# Altium project MOTOR_DRIVER.PrjPcb (part 1 of 2)
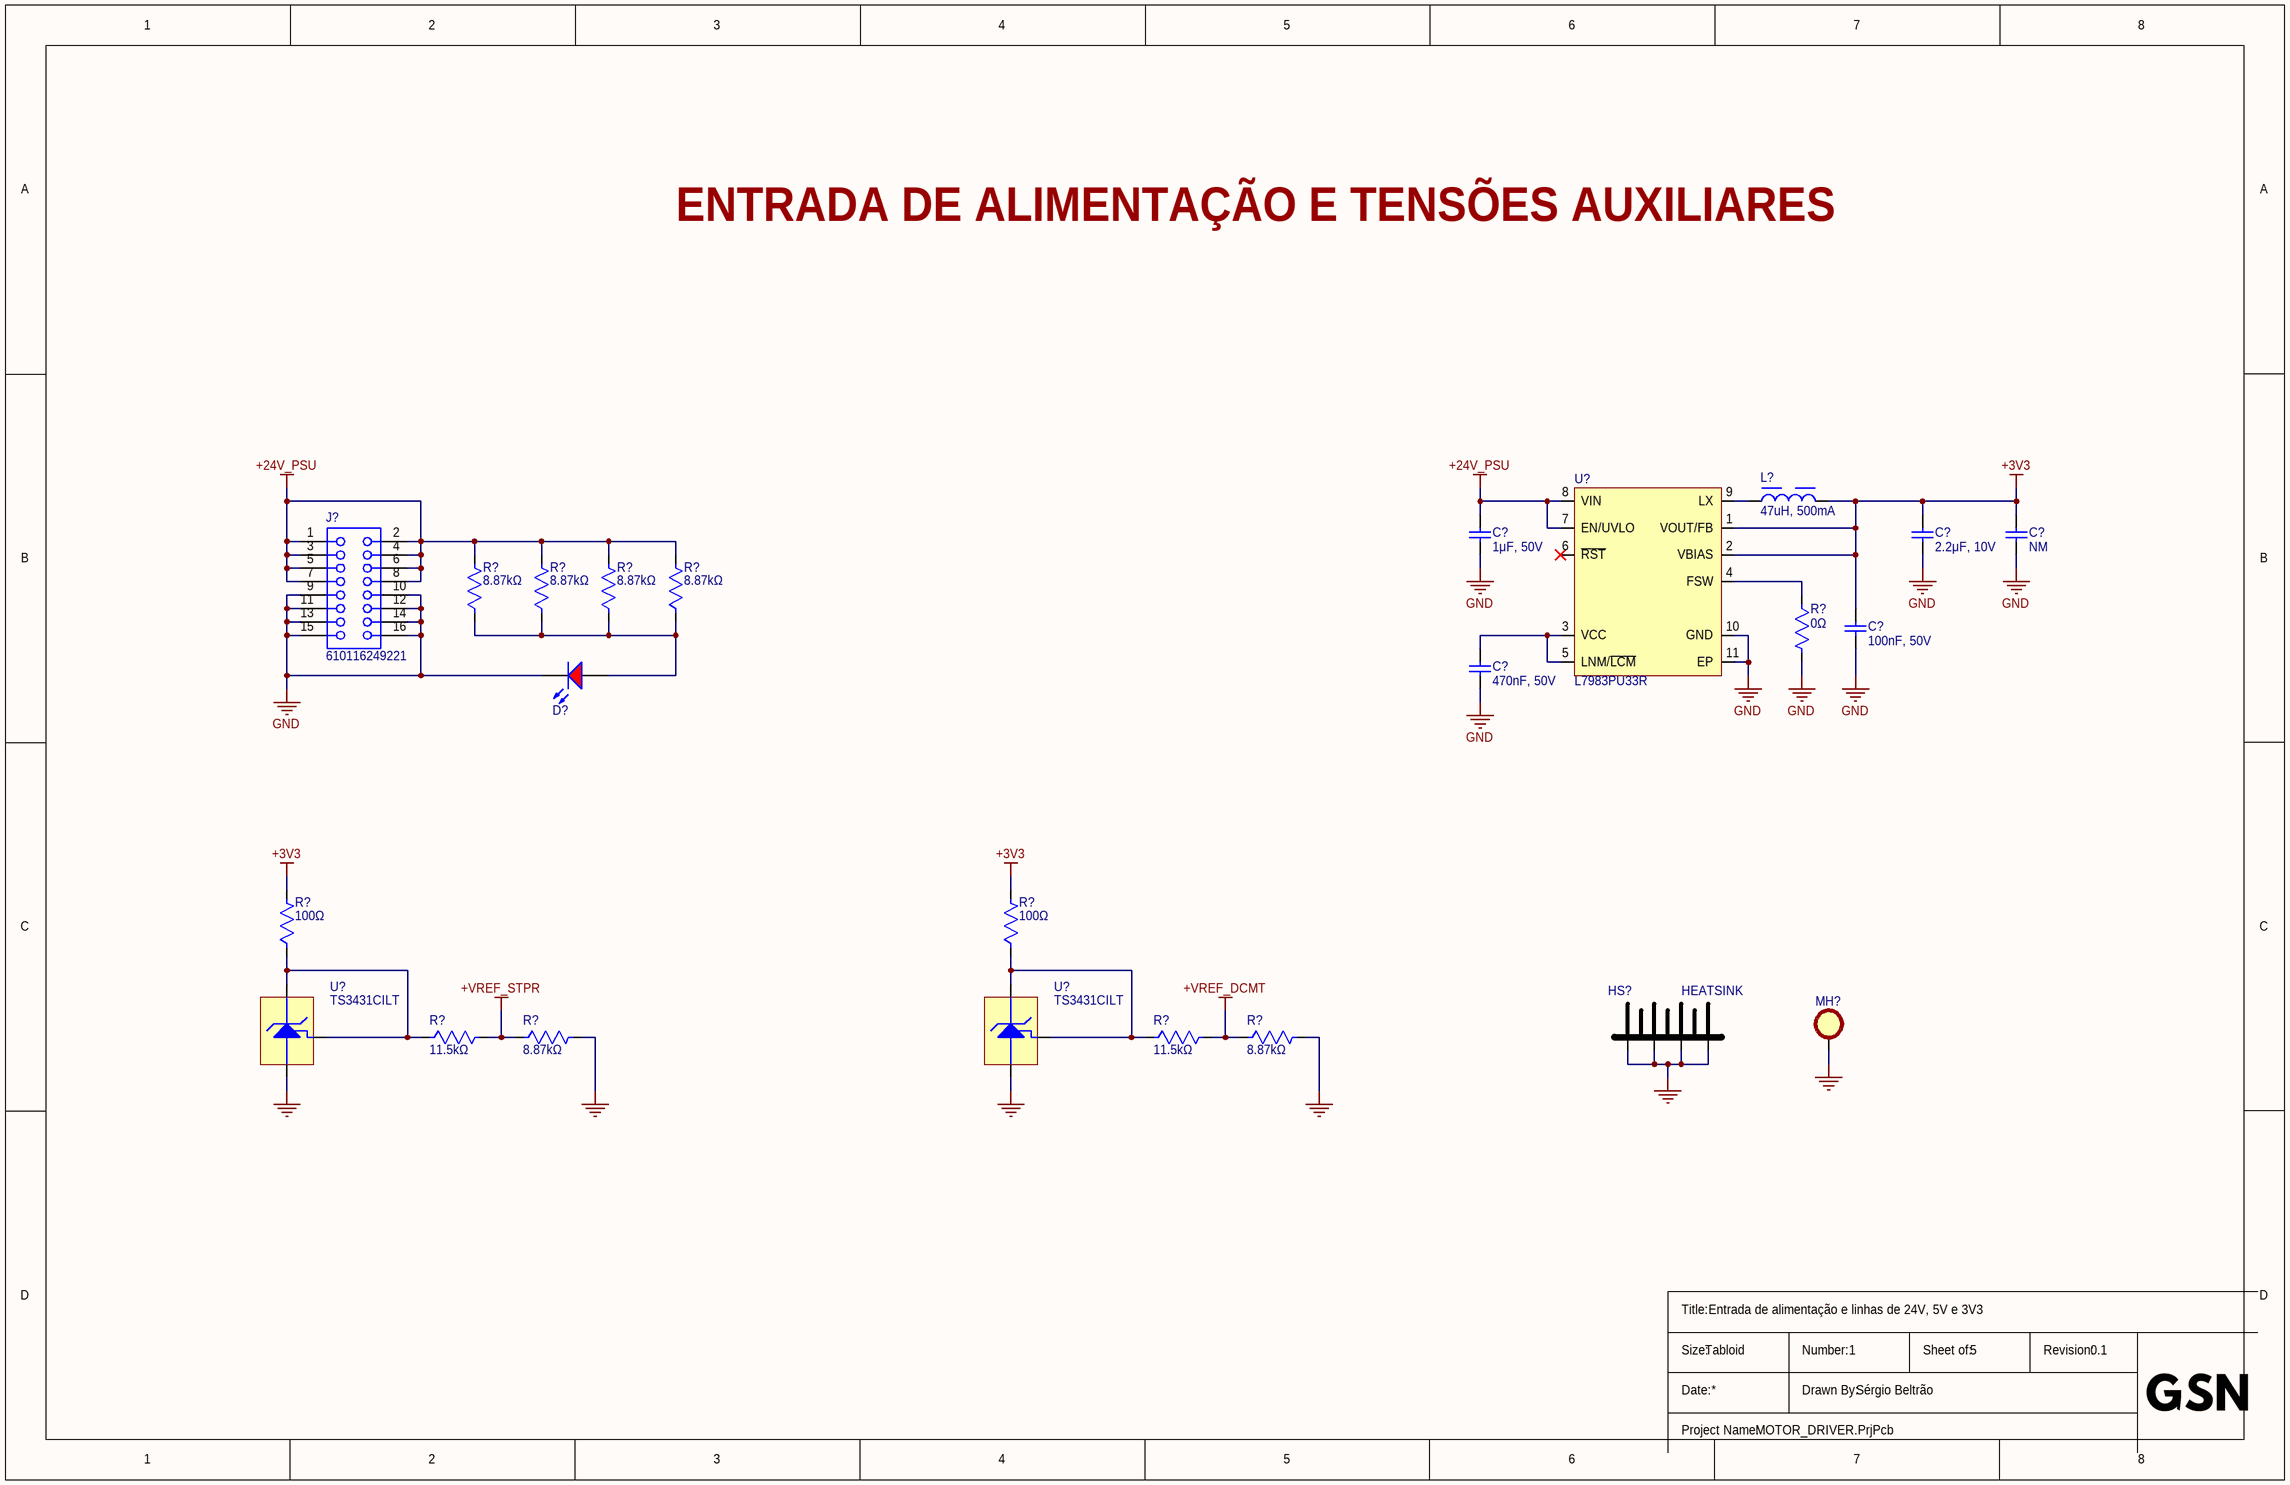
[diagram p0: 1_ENTRADA_DE_ALIMENTACAO.SchDoc]
DrawnBy: Sérgio Beltrão; Revision: 0.1
4 sheets, 121 parts. Net scope: global (net labels, ports and power ports of the same name join across sheets).
Board file: MOTOR_DRIVER.PcbDoc
Sheets:
  1_ENTRADA_DE_ALIMENTACAO.SchDoc
  2_MOTORES_DE_PASSO.SchDoc
  3_MOTORES_DC.SchDoc
  5_IO_EXTERNOS.SchDoc

## Sheet 1_ENTRADA_DE_ALIMENTACAO.SchDoc
size Tabloid; SheetNumber: 1; SheetTotal: 5; SPICEModelCacheBKPNJEUB: <root> / <DocumentId>BKPNJEUB</DocumentId> / <CacheFrame Number="0"> / <Model Name="0603_885012206095_100nf" Kind="CKT"> / <Text>******* / .subckt 0603_885012206095_100nF 1 2 / Rser 1 3 0.0157659152881 / Lser 2 4 3.10171966E-10 / C1 3 4 0.0000001 / Rpar 3 4 5000000000 / .ends 0603_885012206095_100nF</Text> / </Model> / <Model Name="0805_150080rs75000" Kind="CKT"> / <Text>****** / .subckt 0805_150080RS75000  1  2 / D1 1 2 SMCW / .MODEL SMCW D / + IS=10.000E-21 / + N=1.6992 / + RS=1.0000E-6 / + IKF=1.2373E-3 / + CJO=1.0000E-12 / + M=.3333 / + VJ=.75 / + BV=5 / + IBV=10.00E-6 / + TT=5.0000E-9 / .ends</Text> / </Model> / <Model Name="0805_885012207103r_1uf" Kind="CKT"> / <Text>******* / .subckt 0805_885012207103R_1uF 1 2 / Rser 1 3 0.0053065272233 / Lser 2 4 2.83466289E-10 / C1 3 4 0.000001 / Rpar 3 4 100000000 / .ends 0805_885012207103R_1uF</Text> / </Model> / <Model Name="0805_885012207102_470nf" Kind="CKT"> / <Text>******* / .subckt 0805_885012207102_470nF 1 2 / Rser 1 3 0.00874819634126 / Lser 2 4 0.000000000465 / C1 3 4 0.00000047 / Rpar 3 4 1100000000 / .ends 0805_885012207102_470nF</Text> / </Model> / <Model Name="3015_78438335470_47u" Kind="CKT"> / <Text>******* / .subckt 3015_78438335470_47u 1 2 / Rp 1 2 42066.66667 / Cp 1 2 7.59833333333333p / Rs 1 N3 2.09 / L1 N3 2 46.1u / .ends 3015_78438335470_47u</Text> / </Model> / <Model Name="0603_885012206022_220nf" Kind="CKT"> / <Text>******* / .subckt 0603_885012206022_220nF 1 2 / Rser 1 3 0.0146862228843 / Lser 2 4 4.43010481E-10 / C1 3 4 0.00000022 / Rpar 3 4 2300000000 / .ends 0603_885012206022_220nF</Text> / </Model> / <Model Name="0603_885012206027_2.2uf" Kind="CKT"> / <Text>******* / .subckt 0603_885012206027_2.2uF 1 2 / Rser 1 3 0.00844425861819 / Lser 2 4 2.90335669E-10 / C1 3 4 0.0000022 / Rpar 3 4 20000000 / .ends 0603_885012206027_2.2uF</Text> / </Model> / </CacheFrame> / </root>

### Parts
(Parts that share a designator on the sheet are numbered #1, #2 ... from top to bottom, then left to right.)
C?#1  1μF, 50V  [WCAP-CSGP_0805_L2W1.25H1.25]
C?#2  2.2μF, 10V  [WCAP-CSGP_0603_L1.6W0.8H0.8_Reflow]
C?#3  NM  [WCAP-CSGP_0603_L1.6W0.8H0.8_Reflow]
C?#4  100nF, 50V  [WCAP-CSGP_0603_L1.6W0.8H0.8_Reflow]
C?#5  470nF, 50V  [WCAP-CSGP_0805_L2W1.25H1.25]
D?  Red, 2V, 140°  [WL-SMCW_0805_150080xx75000]  (value not drawn)
HS?  HEATSINK  [HEATSINK_100MM_60MM_10MM_LAYING_DOWN]
J?#1  610116249221  [610116249221]
L?  47uH, 500mA  [WE-MAIA_3015]
MH?  Mounting Hole 2.5mm  [MOUNTING_HOLE_M2P5_PLATED]  (value not drawn)  (no BOM)
R?#1  0Ω  [0603-REFLOW]
R?#2  8.87kΩ  [0805-REFLOW]
R?#3  8.87kΩ  [0805-REFLOW]
R?#4  8.87kΩ  [0805-REFLOW]
R?#5  8.87kΩ  [0805-REFLOW]
R?#6  100Ω  [0603-REFLOW]
R?#7  100Ω  [0603-REFLOW]
R?#8  11.5kΩ  [0603-REFLOW]
R?#9  8.87kΩ  [0603-REFLOW]
R?#10  11.5kΩ  [0603-REFLOW]
R?#11  8.87kΩ  [0603-REFLOW]
U?#1  L7983PU33R  [10-WFDFN-EP]
U?#2  TS3431CILT  [SOT-23-3]
U?#3  TS3431CILT  [SOT-23-3]

### Nets
+3V3: C?#2.2 C?#3.2 C?#4.2 L?.2 R?#6.2 R?#7.2 U?#1.1(VOUT/FB) U?#1.2(VBIAS)
+24V_PSU: C?#1.2 J?#1.1 J?#1.2 J?#1.3 J?#1.4 J?#1.5 J?#1.6 J?#1.7 J?#1.8 R?#2.2 R?#3.2 R?#4.2 R?#5.2 U?#1.7(EN/UVLO) U?#1.8(VIN)
+VREF_DCMT: R?#10.2 R?#11.1
+VREF_STPR: R?#8.2 R?#9.1
GND: C?#1.1 C?#2.1 C?#3.1 C?#4.1 C?#5.1 D?.1(K) HS?.H1 HS?.H2 HS?.H3 HS?.H4 J?#1.9 J?#1.10 J?#1.11 J?#1.12 J?#1.13 J?#1.14 J?#1.15 J?#1.16 MH?.H R?#1.2 R?#9.2 R?#11.2 U?#1.10(GND) U?#1.11(EP) U?#2.3(ANODE) U?#3.3(ANODE)
NetC?#5_2: C?#5.2 U?#1.3(VCC) U?#1.5(LNM/~{LCM})
NetD?_2: D?.2(A) R?#2.1 R?#3.1 R?#4.1 R?#5.1
NetL?_1: L?.1 U?#1.9(LX)
NetR?#1_1: R?#1.1 U?#1.4(FSW)
NetR?#6_1: R?#6.1 R?#8.1 U?#2.1(REF) U?#2.2(CATHODE)
NetR?#7_1: R?#7.1 R?#10.1 U?#3.1(REF) U?#3.2(CATHODE)

Not connected (* = marked no-connect by the designer): U?#1 6(~{RST})*

### Notes on the sheet
- ENTRADA DE ALIMENTAÇÃO E TENSÕES AUXILIARES
- Entrada de alimentação e linhas de 24V, 5V e 3V3
- Title:
- Size:
- Tabloid
- Number:
- Sheet of:
- Revision:
- Date:
- Project Name:
- Drawn By:

### Library data of the parts
C?#1 = 885012207103R: WCAP-CSGP Multilayer Ceramic Chip Capacitor, General Purpose, size 0805, 1μF, 50V; Manufacturer: Wurth Elektronik; Case/Size Code: 0805; Capacitance: 1uF; Capacitance Tolerance: +/-10%; Ceramic Type: X7R; Dissipation Factor: 10%; Insulation Resistance: 0.1Gohm; Technical Reference: X7R0805105K050DFCT20000; Manufacturer Part Number: 885012207103R; Category: Multilayer Ceramic Chip Capacitors; Match Code: WCAP-CSGP; ComponentLink1Description: Website Link; ComponentLink1URL: https://www.we-online.com/redexpert/article/885012207103R?ad; ComponentLink2Description: Datasheet Link; ComponentLink2URL: https://www.we-online.com/redexpert/spec/885012207103R?ad; Mount: Surface Mount; Operating Temperature Min: -55degC; Operating Temperature Max: 125degC; Packaging: Tape and Reel; Length: 2mm; Width: 1.25mm; Height: 1.25mm; Rated Voltage (DC): 50V
C?#2 = 885012206027: WCAP-CSGP Multilayer Ceramic Chip Capacitor, General Purpose, size 0603, 2.2μF, 10V; Manufacturer: Wurth Elektronik; Case/Size Code: 0603; Capacitance: 2.2uF; Capacitance Tolerance: +/-10%; Ceramic Type: X7R; Dissipation Factor: 10%; Insulation Resistance: 0.02Gohm; Technical Reference: X7R0603225K010DFCT10000; Manufacturer Part Number: 885012206027; Category: Multilayer Ceramic Chip Capacitors; Match Code: WCAP-CSGP; ComponentLink1Description: Website Link; ComponentLink1URL: https://www.we-online.com/redexpert/article/885012206027?ad; ComponentLink2Description: Datasheet Link; ComponentLink2URL: https://www.we-online.com/redexpert/spec/885012206027?ad; Mount: Surface Mount; Operating Temperature Min: -55degC; Operating Temperature Max: 125degC; Packaging: Tape and Reel; Length: 1.6mm; Width: 0.8mm; Height: 0.8mm; Rated Voltage (DC): 10V
C?#3 = 885012206022: WCAP-CSGP Multilayer Ceramic Chip Capacitor, General Purpose, size 0603, 220nF, 10V; Manufacturer: Wurth Elektronik; Case/Size Code: 0603; Capacitance Tolerance: +/-10%; Ceramic Type: X7R; Dissipation Factor: 5%; Insulation Resistance: 2.3Gohm; Technical Reference: X7R0603224K010DFCT10000; Manufacturer Part Number: 885012206022; Category: Multilayer Ceramic Chip Capacitors; Match Code: WCAP-CSGP; ComponentLink1Description: Website Link; ComponentLink1URL: https://www.we-online.com/redexpert/article/885012206022?ad; ComponentLink2Description: Datasheet Link; ComponentLink2URL: https://www.we-online.com/redexpert/spec/885012206022?ad; Mount: Surface Mount; Operating Temperature Min: -55degC; Operating Temperature Max: 125degC; Packaging: Tape and Reel; Length: 1.6mm; Width: 0.8mm; Height: 0.8mm; Capacitance: 220nF; Rated Voltage (DC): 10V
C?#4 = 885012206095: WCAP-CSGP Multilayer Ceramic Chip Capacitor, General Purpose, size 0603, 100nF, 50V; Manufacturer: Wurth Elektronik; Case/Size Code: 0603; Capacitance Tolerance: +/-10%; Ceramic Type: X7R; Dissipation Factor: 3%; Insulation Resistance: 5Gohm; Technical Reference: X7R0603104K050DFCT10000; Manufacturer Part Number: 885012206095; Category: Multilayer Ceramic Chip Capacitors; Match Code: WCAP-CSGP; ComponentLink1Description: Website Link; ComponentLink1URL: https://www.we-online.com/redexpert/article/885012206095?ad; ComponentLink2Description: Datasheet Link; ComponentLink2URL: https://www.we-online.com/redexpert/spec/885012206095?ad; Mount: Surface Mount; Operating Temperature Min: -55degC; Operating Temperature Max: 125degC; Packaging: Tape and Reel; Length: 1.6mm; Width: 0.8mm; Height: 0.8mm; Capacitance: 100nF; Rated Voltage (DC): 50V
C?#5 = 885012207102: WCAP-CSGP Multilayer Ceramic Chip Capacitor, General Purpose, size 0805, 470nF, 50V; Manufacturer: Wurth Elektronik; Case/Size Code: 0805; Capacitance Tolerance: +/-10%; Ceramic Type: X7R; Dissipation Factor: 3%; Insulation Resistance: 1.1Gohm; Technical Reference: X7R0805474K050DFCT10000; Manufacturer Part Number: 885012207102; Category: Multilayer Ceramic Chip Capacitors; Match Code: WCAP-CSGP; ComponentLink1Description: Website Link; ComponentLink1URL: https://www.we-online.com/redexpert/article/885012207102?ad; ComponentLink2Description: Datasheet Link; ComponentLink2URL: https://www.we-online.com/redexpert/spec/885012207102?ad; Mount: Surface Mount; Operating Temperature Min: -55degC; Operating Temperature Max: 125degC; Packaging: Tape and Reel; Length: 2mm; Width: 1.25mm; Height: 1.25mm; Capacitance: 470nF; Rated Voltage (DC): 50V
D? = 150080RS75000: WL-SMCW Mono-color Chip LED Waterclear, SMT, size 0805, Red, 2V, 140°; Manufacturer: Wurth Elektronik; Case/Size Code: 0805; Chip Technology: AlInGaP; Dominant Wavelength: 625nm; Luminous Intensity: 150mcd; Peak Wavelength: 630nm; Manufacturer Part Number: 150080RS75000; Category: Signal LEDs; Match Code: WL-SMCW; ComponentLink1Description: Website Link; ComponentLink1URL: https://www.we-online.com/redexpert/article/150080RS75000?ad; ComponentLink2Description: Datasheet Link; ComponentLink2URL: https://www.we-online.com/redexpert/spec/150080RS75000?ad; Mount: Surface Mount; Min Operating Temperature: -40°C; Max Operating Temperature: 85°C; Packaging: Tape and Reel; Length: 2mm; Width: 1.25mm; Height: 0.7mm; Emitting Color: Red; Forward Voltage: 2V; Viewing Angle: 140°
HS? = GENERIC-HEATSINK-100X60X10MM-LD: GENERIC HEATSINK 100X60X10MM; Manufacturer: OEM; Manufacturer Part Number: None
J?#1 = 610116249221: WR-PHD Socket Header, SMT, Angled, pitch 2.54mm, 2 Row, 16P; Manufacturer: Wurth Elektronik; Contact Resistance: 20mOhm; Rated Current: 3A; Working Voltage: 250V; Withstanding Voltage: 600V; Manufacturer Part Number: 610116249221; Category: Board-to-Board Connectors; Match Code: WR-PHD; ComponentLink1Description: Website Link; ComponentLink1URL: https://www.we-online.com/redexpert/article/610116249221?ad; ComponentLink2Description: Datasheet Link; ComponentLink2URL: https://www.we-online.com/redexpert/spec/610116249221?ad; Mount: Surface Mount; Operating Temperature Min: -40degC; Operating Temperature Max: 105degC; Packaging: Tape and Reel; Gender: Socket Header; Number of Pins: 16; Number of Rows: 2; Orientation: Angled; Lead Pitch: 2.54mm
L? = 78438335470: WE-MAIA SMT Power Inductor, size 3015, 47uH, 0.5A, 2300mohm; Manufacturer: Wurth Elektronik; Case/Size Code: 3015; Saturation Current @ 10%: 0.75A; Saturation Current @ 30%: 1.5A; Self Resonant Frequency: 8MHz; Manufacturer Part Number: 78438335470; Category: Power Inductors; Match Code: WE-MAIA; ComponentLink1Description: Website Link; ComponentLink1URL: https://www.we-online.com/redexpert/article/78438335470?ad; ComponentLink2Description: Datasheet Link; ComponentLink2URL: https://www.we-online.com/redexpert/spec/78438335470?ad; Mount: Surface Mount; Operating Temperature Min: -40degC; Operating Temperature Max: 125degC; Packaging: Tape and Reel; Length: 3mm; Width: 3mm; Height: 1.5mm; Automotive: Yes; DC Resistance Max: 2300mohm; Inductance: 47uH; Rated Current: 0.5A
MH? = MTH-2P5MM-PLATED: PLATED MOUNTING HOLE WITH 2.5MM DIAMETER
R?#1 = RC0603FR-070RL: RES 0 OHM 1% 1/10W 0603; Manufacturer: Yageo Group; Max Power Dissipation: 100mW; Temperature Coefficient: ±200ppm/°C; Voltage Rating (AC): 50V; Voltage Rating: 75V; Supplier Part Number: 311-0.0HRCT-ND; Manufacturer Part Number: RC0603FR-070RL; Value: 0Ω; Case Code (Imperial): 0603; Case Code (Metric): 1608; Case/Package: 0603; Category: Chip SMD Resistors; China RoHS: Non-Compliant; Composition: Thick Film; Contact Plating: Tin; Depth: 800µm; Features: Moisture Resistant; Height: 450µm; Lead Free: Lead Free; Length: 1.6mm; Lifecycle Status: Production; Max Operating Temperature: 155°C; Military Standard: Not; Min Operating Temperature: -55°C; Mounting Technology: Surface Mount; Number of Terminals: 2; Number of Terminations: 2; Packaging: Tape & Reel; Power Dissipation: 100mW; Power Rating: 100mW; Radiation Hardening: No; REACH SVHC: Yes; RoHS: Compliant; Supplier: DigiKey; Termination: SMD/SMT; Tolerance: 1%; Component Link Description: https://www.yageogroup.com/content/datasheet/asset/file/PYU-RC_GROUP_51_ROHS_L; Component Link URL: https://www.yageogroup.com/content/datasheet/asset/file/PYU-RC_GROUP_51_ROHS_L; Datasheet: https://www.yageogroup.com/content/datasheet/asset/file/PYU-RC_GROUP_51_ROHS_L; Voltage Rating (DC): 50V; Weight: 2.012816mg; Width: 800µm; Working Voltage: 75V
R?#2-R?#5 = RC0805FR-078K87L: RES 8.87K OHM 1% 1/8W 0805; Manufacturer: Yageo Group; Max Power Dissipation: 125mW; Temperature Coefficient: 100ppm/°C; Voltage Rating: 150V; Supplier: DigiKey; Supplier Part Number: 311-8.87KCRCT-ND; Manufacturer Part Number: RC0805FR-078K87L; RoHS: Compliant; Category: Chip SMD Resistors; Stock: 98675; Pricing: 1=0.1, 10=0.008, 25=0.0072 (USD); Case/Package: 0805; Case Code (Imperial): 0805; China RoHS: Non-Compliant; Composition: Thick Film; Contact Plating: Lead, Tin; Depth: 1.25mm; Features: Moisture Resistant; Height: 500µm; Lead Free: Lead Free; Length: 2mm; Lifecycle Status: Production; Max Operating Temperature: 155°C; Military Standard: Not; Min Operating Temperature: -55°C; Mounting Technology: Surface Mount; Number of Terminals: 2; Number of Terminations: 2; Power Dissipation: 125mW; Power Rating: 125mW; Radiation Hardening: No; REACH SVHC: Yes; Value: 8.87kΩ; Schedule B: 8533210045, 8533210045|8533210045|8533210045|8533210045|8533210045; Termination: SMD/SMT; Tolerance: 1%; Voltage Rating (DC): 150V; Width: 1.25mm; Working Voltage: 150V; ComponentLink1URL: https://datasheet.octopart.com:443/RC0805FR-078K87L-Yageo-datasheet-175887523.pdf?src-supplier=Newark; ComponentLink1Description: https://datasheet.octopart.com:443/RC0805FR-078K87L-Yageo-datasheet-175887523.pdf?src-supplier=Newark; ComponentLink2URL: https://datasheet.octopart.com:443/RC0805FR-078K87L-Yageo-datasheet-103092701.pdf?src-supplier=Upverter; ComponentLink2Description: https://datasheet.octopart.com:443/RC0805FR-078K87L-Yageo-datasheet-103092701.pdf?src-supplier=Upverter; ComponentLink3URL: https://datasheet.octopart.com:443/RC0805FR-078K87L-Yageo-Group-datasheet-176638170.pdf?src-supplier=Future+Electronics; ComponentLink3Description: https://datasheet.octopart.com:443/RC0805FR-078K87L-Yageo-Group-datasheet-176638170.pdf?src-supplier=Future+Electronics; ComponentLink4URL: https://datasheet.octopart.com:443/RC0805FR-078K87L-Yageo-datasheet-164759695.pdf?src-supplier=Future+Electronics; ComponentLink4Description: https://datasheet.octopart.com:443/RC0805FR-078K87L-Yageo-datasheet-164759695.pdf?src-supplier=Future+Electronics; ComponentLink5URL: https://datasheet.octopart.com:443/RC0805FR-078K87L-Yageo-datasheet-12592811.pdf?src-supplier=Future+Electronics; ComponentLink5Description: https://datasheet.octopart.com:443/RC0805FR-078K87L-Yageo-datasheet-12592811.pdf?src-supplier=Future+Electronics; ComponentLink6URL: https://datasheet.octopart.com:443/RC0805FR-078K87L-Yageo-datasheet-8330313.pdf?src-supplier=Future+Electronics; ComponentLink6Description: https://datasheet.octopart.com:443/RC0805FR-078K87L-Yageo-datasheet-8330313.pdf?src-supplier=Future+Electronics; ComponentLink7URL: https://datasheet.octopart.com:443/RC0805FR-078K87L-Yageo-datasheet-8324252.pdf?src-supplier=Future+Electronics; ComponentLink7Description: https://datasheet.octopart.com:443/RC0805FR-078K87L-Yageo-datasheet-8324252.pdf?src-supplier=Future+Electronics; ComponentLink8URL: https://datasheet.octopart.com/RC0805FR-078K87L-Yageo-datasheet-73766026.pdf; ComponentLink8Description: https://datasheet.octopart.com/RC0805FR-078K87L-Yageo-datasheet-73766026.pdf; ComponentLink9URL: https://datasheet.octopart.com:443/RC0805FR-078K87L-Yageo-datasheet-118657.pdf?src-supplier=DigiKey; ComponentLink9Description: https://datasheet.octopart.com:443/RC0805FR-078K87L-Yageo-datasheet-118657.pdf?src-supplier=DigiKey; ComponentLink10URL: http://sigma.octopart.com:80/conflict_mineral_statement/Yageo-company-3.pdf?src-supplier=Compliance+Statements; ComponentLink10Description: http://sigma.octopart.com:80/conflict_mineral_statement/Yageo-company-3.pdf?src-supplier=Compliance+Statements; ComponentLink11URL: http://sigma.octopart.com:80/rohs_statement/Yageo-company-2.pdf?src-supplier=Compliance+Statements; ComponentLink11Description: http://sigma.octopart.com:80/rohs_statement/Yageo-company-2.pdf?src-supplier=Compliance+Statements
R?#6 R?#7 = RC0603FR-07100RL: RES 100 OHM 1% 1/10W 0603; Manufacturer: Yageo Group; Max Power Dissipation: 100mW; Temperature Coefficient: ±200ppm/°C; Voltage Rating (AC): 50V; Voltage Rating: 75V; Supplier Part Number: 311-100HRCT-ND; Manufacturer Part Number: RC0603FR-07100RL; Value: 100Ω; Case Code (Imperial): 0603; Case Code (Metric): 1608; Case/Package: 0603; Category: Chip SMD Resistors; China RoHS: Non-Compliant; Composition: Thick Film; Contact Plating: Tin; Depth: 800µm; Features: Moisture Resistant; Height: 450µm; Lead Free: Lead Free; Length: 1.6mm; Lifecycle Status: Production; Max Operating Temperature: 155°C; Military Standard: Not; Min Operating Temperature: -55°C; Mounting Technology: Surface Mount; Number of Terminals: 2; Number of Terminations: 2; Packaging: Tape & Reel; Power Dissipation: 100mW; Power Rating: 100mW; Radiation Hardening: No; REACH SVHC: Yes; RoHS: Compliant; Supplier: DigiKey; Termination: SMD/SMT; Tolerance: 1%; Component Link Description: https://www.yageogroup.com/content/datasheet/asset/file/PYU-RC_GROUP_51_ROHS_L; Component Link URL: https://www.yageogroup.com/content/datasheet/asset/file/PYU-RC_GROUP_51_ROHS_L; Datasheet: https://www.yageogroup.com/content/datasheet/asset/file/PYU-RC_GROUP_51_ROHS_L; Voltage Rating (DC): 50V; Weight: 2.012816mg; Width: 800µm; Working Voltage: 75V
R?#8 R?#10 = RC0603FR-0711K5L: RES 11.5K OHM 1% 1/10W 0603; Manufacturer: Yageo Group; Max Power Dissipation: 100mW; Temperature Coefficient: ±200ppm/°C; Voltage Rating (AC): 50V; Voltage Rating: 75V; Supplier Part Number: 311-11.5KHRCT-ND; Manufacturer Part Number: RC0603FR-0711K5L; Value: 11.5kΩ; Case Code (Imperial): 0603; Case Code (Metric): 1608; Case/Package: 0603; Category: Chip SMD Resistors; China RoHS: Non-Compliant; Composition: Thick Film; Contact Plating: Tin; Depth: 800µm; Features: Moisture Resistant; Height: 450µm; Lead Free: Lead Free; Length: 1.6mm; Lifecycle Status: Production; Max Operating Temperature: 155°C; Military Standard: Not; Min Operating Temperature: -55°C; Mounting Technology: Surface Mount; Number of Terminals: 2; Number of Terminations: 2; Packaging: Tape & Reel; Power Dissipation: 100mW; Power Rating: 100mW; Radiation Hardening: No; REACH SVHC: Yes; RoHS: Compliant; Supplier: DigiKey; Termination: SMD/SMT; Tolerance: 1%; Component Link Description: https://www.yageogroup.com/content/datasheet/asset/file/PYU-RC_GROUP_51_ROHS_L; Component Link URL: https://www.yageogroup.com/content/datasheet/asset/file/PYU-RC_GROUP_51_ROHS_L; Datasheet: https://www.yageogroup.com/content/datasheet/asset/file/PYU-RC_GROUP_51_ROHS_L; Voltage Rating (DC): 50V; Weight: 2.012816mg; Width: 800µm; Working Voltage: 75V
R?#9 R?#11 = RC0603FR-078K87L: RES 8.87K OHM 1% 1/10W 0603; Manufacturer: Yageo Group; Max Power Dissipation: 100mW; Temperature Coefficient: ±200ppm/°C; Voltage Rating (AC): 50V; Voltage Rating: 75V; Supplier Part Number: 311-8.87KHRCT-ND; Manufacturer Part Number: RC0603FR-078K87L; Value: 8.87kΩ; Case Code (Imperial): 0603; Case Code (Metric): 1608; Case/Package: 0603; Category: Chip SMD Resistors; China RoHS: Non-Compliant; Composition: Thick Film; Contact Plating: Tin; Depth: 800µm; Features: Moisture Resistant; Height: 450µm; Lead Free: Lead Free; Length: 1.6mm; Lifecycle Status: Production; Max Operating Temperature: 155°C; Military Standard: Not; Min Operating Temperature: -55°C; Mounting Technology: Surface Mount; Number of Terminals: 2; Number of Terminations: 2; Packaging: Tape & Reel; Power Dissipation: 100mW; Power Rating: 100mW; Radiation Hardening: No; REACH SVHC: Yes; RoHS: Compliant; Supplier: DigiKey; Termination: SMD/SMT; Tolerance: 1%; Component Link Description: https://www.yageogroup.com/content/datasheet/asset/file/PYU-RC_GROUP_51_ROHS_L; Component Link URL: https://www.yageogroup.com/content/datasheet/asset/file/PYU-RC_GROUP_51_ROHS_L; Datasheet: https://www.yageogroup.com/content/datasheet/asset/file/PYU-RC_GROUP_51_ROHS_L; Voltage Rating (DC): 50V; Weight: 2.012816mg; Width: 800µm; Working Voltage: 75V
U?#1 = L7983PU33R: IC REG BUCK 3.3V 300MA 10DFN; Manufacturer: STMicroelectronics; Max Supply Voltage: 60V; Max Switching Frequency: 2.42MHz; Min Input Voltage: 3.5V; Min Output Voltage: 850mV; Nominal Supply Voltage: 24V; Number of Circuits: 1; Quiescent Current: 10µA; Synchronous Rectifier: Yes; Supplier: DigiKey; Supplier Part Number: 497-L7983PU33RCT-ND; Manufacturer Part Number: L7983PU33R; RoHS: Compliant; Category: Voltage Regulators - Switching; Stock: 4366; Pricing: 1=2.69, 10=2.001, 25=1.83, 100=1.6411, 250=1.55108, 500=1.5155 (USD); China RoHS: Compliant; Country of Origin: Mainland China; Export Control Classification Number (ECCN) Code: EAR99; Height - Seated (Max): 800µm; Harmonized Tariff Schedule (HTS) Code: 8542.39.00.60; Introduction Date: 2020-10-06; Length: 3mm; Lifecycle Status: Production; Max Operating Temperature: 150°C; Max Output current: 300mA; Max Output Voltage: 60V; Min Operating Temperature: -40°C; Nominal Output Voltage: 3.3V; Number of Terminals: 10; Output Current: 300mA; Packaging: Tape and Reel; REACH SVHC: Yes; Schedule B: 8542390000, 8542390000|8542390000|8542390000|8542390000|8542390000|8542390000|8542390000|8542390000|8542390000|8542390000|8542390000|8542390000|8542390000|8542390000|8542390000|8542390000|8542390000|8542390000|8542390000|8542390000|8542390000|8542390000|8542390000|85; Terminal Pitch: 500µm; Topology: Buck; Width: 3mm
U?#2 U?#3 = TS3431CILT: IC VREF SHUNT ADJ 0.25% SOT23-3; Manufacturer: STMicroelectronics; Cathode Current: 400µA; Max Supply Voltage: 25V; Max Output current: 100mA; Max Output Voltage: 1.243V; Min Output Voltage: 1.237V; Min Supply Voltage: 1.24V; Number of Channels: 1; Output Voltage: 24V; Reference Type: Adjustable, Shunt; Temperature Coefficient: 100ppm/°C; Supplier: DigiKey; Supplier Part Number: 497-4637-1-ND; Manufacturer Part Number: TS3431CILT; RoHS: Compliant; Category: Voltage References; Stock: 16066; Pricing: 1=0.62, 10=0.44, 25=0.3944, 100=0.3441, 250=0.32016, 500=0.30574, 1000=0.29386 (USD); Case/Package: SOT-23; China RoHS: Compliant; Height: 1.02mm; Height - Seated (Max): 1.12mm; Lead Free: Lead Free; Length: 2.9mm; Lifecycle Status: Production; Max Operating Temperature: 125°C; Min Operating Temperature: -40°C; Mounting Technology: Surface Mount; Nominal Supply Voltage: 1.24V; Nominal Output Voltage: 1.24V; Nominal Supply Current: 400µA; Number of Circuits: 1; Number of Outputs: 1; Pins: 3; Number of Terminals: 3; Output Current: 100mA; Packaging: Tape and Reel; Radiation Hardening: No; REACH SVHC: Yes; Reference Voltage: 1.24V; Schedule B: 8542390000, 8542390000|8542390000|8542390000|8542390000|8542390000; Terminal Pitch: 950µm; Termination: SMD/SMT; Tolerance: 0.25%; Width: 1.3mm; ComponentLink1URL: https://datasheet.octopart.com:443/TS3431CILT-STMicroelectronics-datasheet-12523092.pdf?src-supplier=SHENGYU+ELECTRONICS; ComponentLink1Description: https://datasheet.octopart.com:443/TS3431CILT-STMicroelectronics-datasheet-12523092.pdf?src-supplier=SHENGYU+ELECTRONICS; ComponentLink2URL: https://datasheet.octopart.com:443/TS3431CILT-STMicroelectronics-datasheet-10408717.pdf?src-supplier=Upverter; ComponentLink2Description: https://datasheet.octopart.com:443/TS3431CILT-STMicroelectronics-datasheet-10408717.pdf?src-supplier=Upverter; ComponentLink3URL: https://datasheet.octopart.com:443/TS3431CILT-STMicroelectronics-datasheet-124172.pdf?src-supplier=Farnell; ComponentLink3Description: https://datasheet.octopart.com:443/TS3431CILT-STMicroelectronics-datasheet-124172.pdf?src-supplier=Farnell; ComponentLink4URL: https://datasheet.octopart.com:443/TS3431CILT-STMicroelectronics-datasheet-140368796.pdf?src-supplier=TME; ComponentLink4Description: https://datasheet.octopart.com:443/TS3431CILT-STMicroelectronics-datasheet-140368796.pdf?src-supplier=TME; ComponentLink5URL: https://datasheet.octopart.com:443/TS3431CILT-STMicroelectronics-datasheet-18487.pdf?src-supplier=DigiKey; ComponentLink5Description: https://datasheet.octopart.com:443/TS3431CILT-STMicroelectronics-datasheet-18487.pdf?src-supplier=DigiKey

## Sheet 2_MOTORES_DE_PASSO.SchDoc
size Tabloid; SheetNumber: 2; SheetTotal: 4; SPICEModelCacheVFRLFGQA: <root> / <DocumentId>VFRLFGQA</DocumentId> / <CacheFrame Number="0"> / <Model Name="0603_885012206023_330nf" Kind="CKT"> / <Text>******* / .subckt 0603_885012206023_330nF 1 2 / Rser 1 3 0.0113479919005 / Lser 2 4 4.48567636E-10 / C1 3 4 0.00000033 / Rpar 3 4 1500000000 / .ends 0603_885012206023_330nF</Text> / </Model> / <Model Name="0603_885012206008_1nf" Kind="CKT"> / <Text>******* / .subckt 0603_885012206008_1nF 1 2 / Rser 1 3 0.24958 / Lser 2 4 0.00000000040399 / C1 3 4 0.000000001 / Rpar 3 4 10000000000 / .ends 0603_885012206008_1nF</Text> / </Model> / <Model Name="0603_885012206014_10nf" Kind="CKT"> / <Text>******* / .subckt 0603_885012206014_10nF 1 2 / Rser 1 3 0.04641 / Lser 2 4 0.00000000025735 / C1 3 4 0.00000001 / Rpar 3 4 10000000000 / .ends 0603_885012206014_10nF</Text> / </Model> / <Model Name="0603_885012206121_330nf" Kind="CKT"> / <Text>******* / .subckt 0603_885012206121_330nF 1 2 / Rser 1 3 0.0116331902783 / Lser 2 4 2.98906197E-10 / C1 3 4 0.00000033 / Rpar 3 4 1500000000 / .ends 0603_885012206121_330nF</Text> / </Model> / <Model Name="865080649011_33uf" Kind="CKT"> / <Text>******* / .subckt 865080649011_33uF 1 2 / Rser 1 3 0.64 / Lser 2 4 0.000000003917 / C1 3 4 0.000033 / Rpar 3 4 3030303.03030303 / .ends 865080649011_33uF</Text> / </Model> / </CacheFrame> / </root>
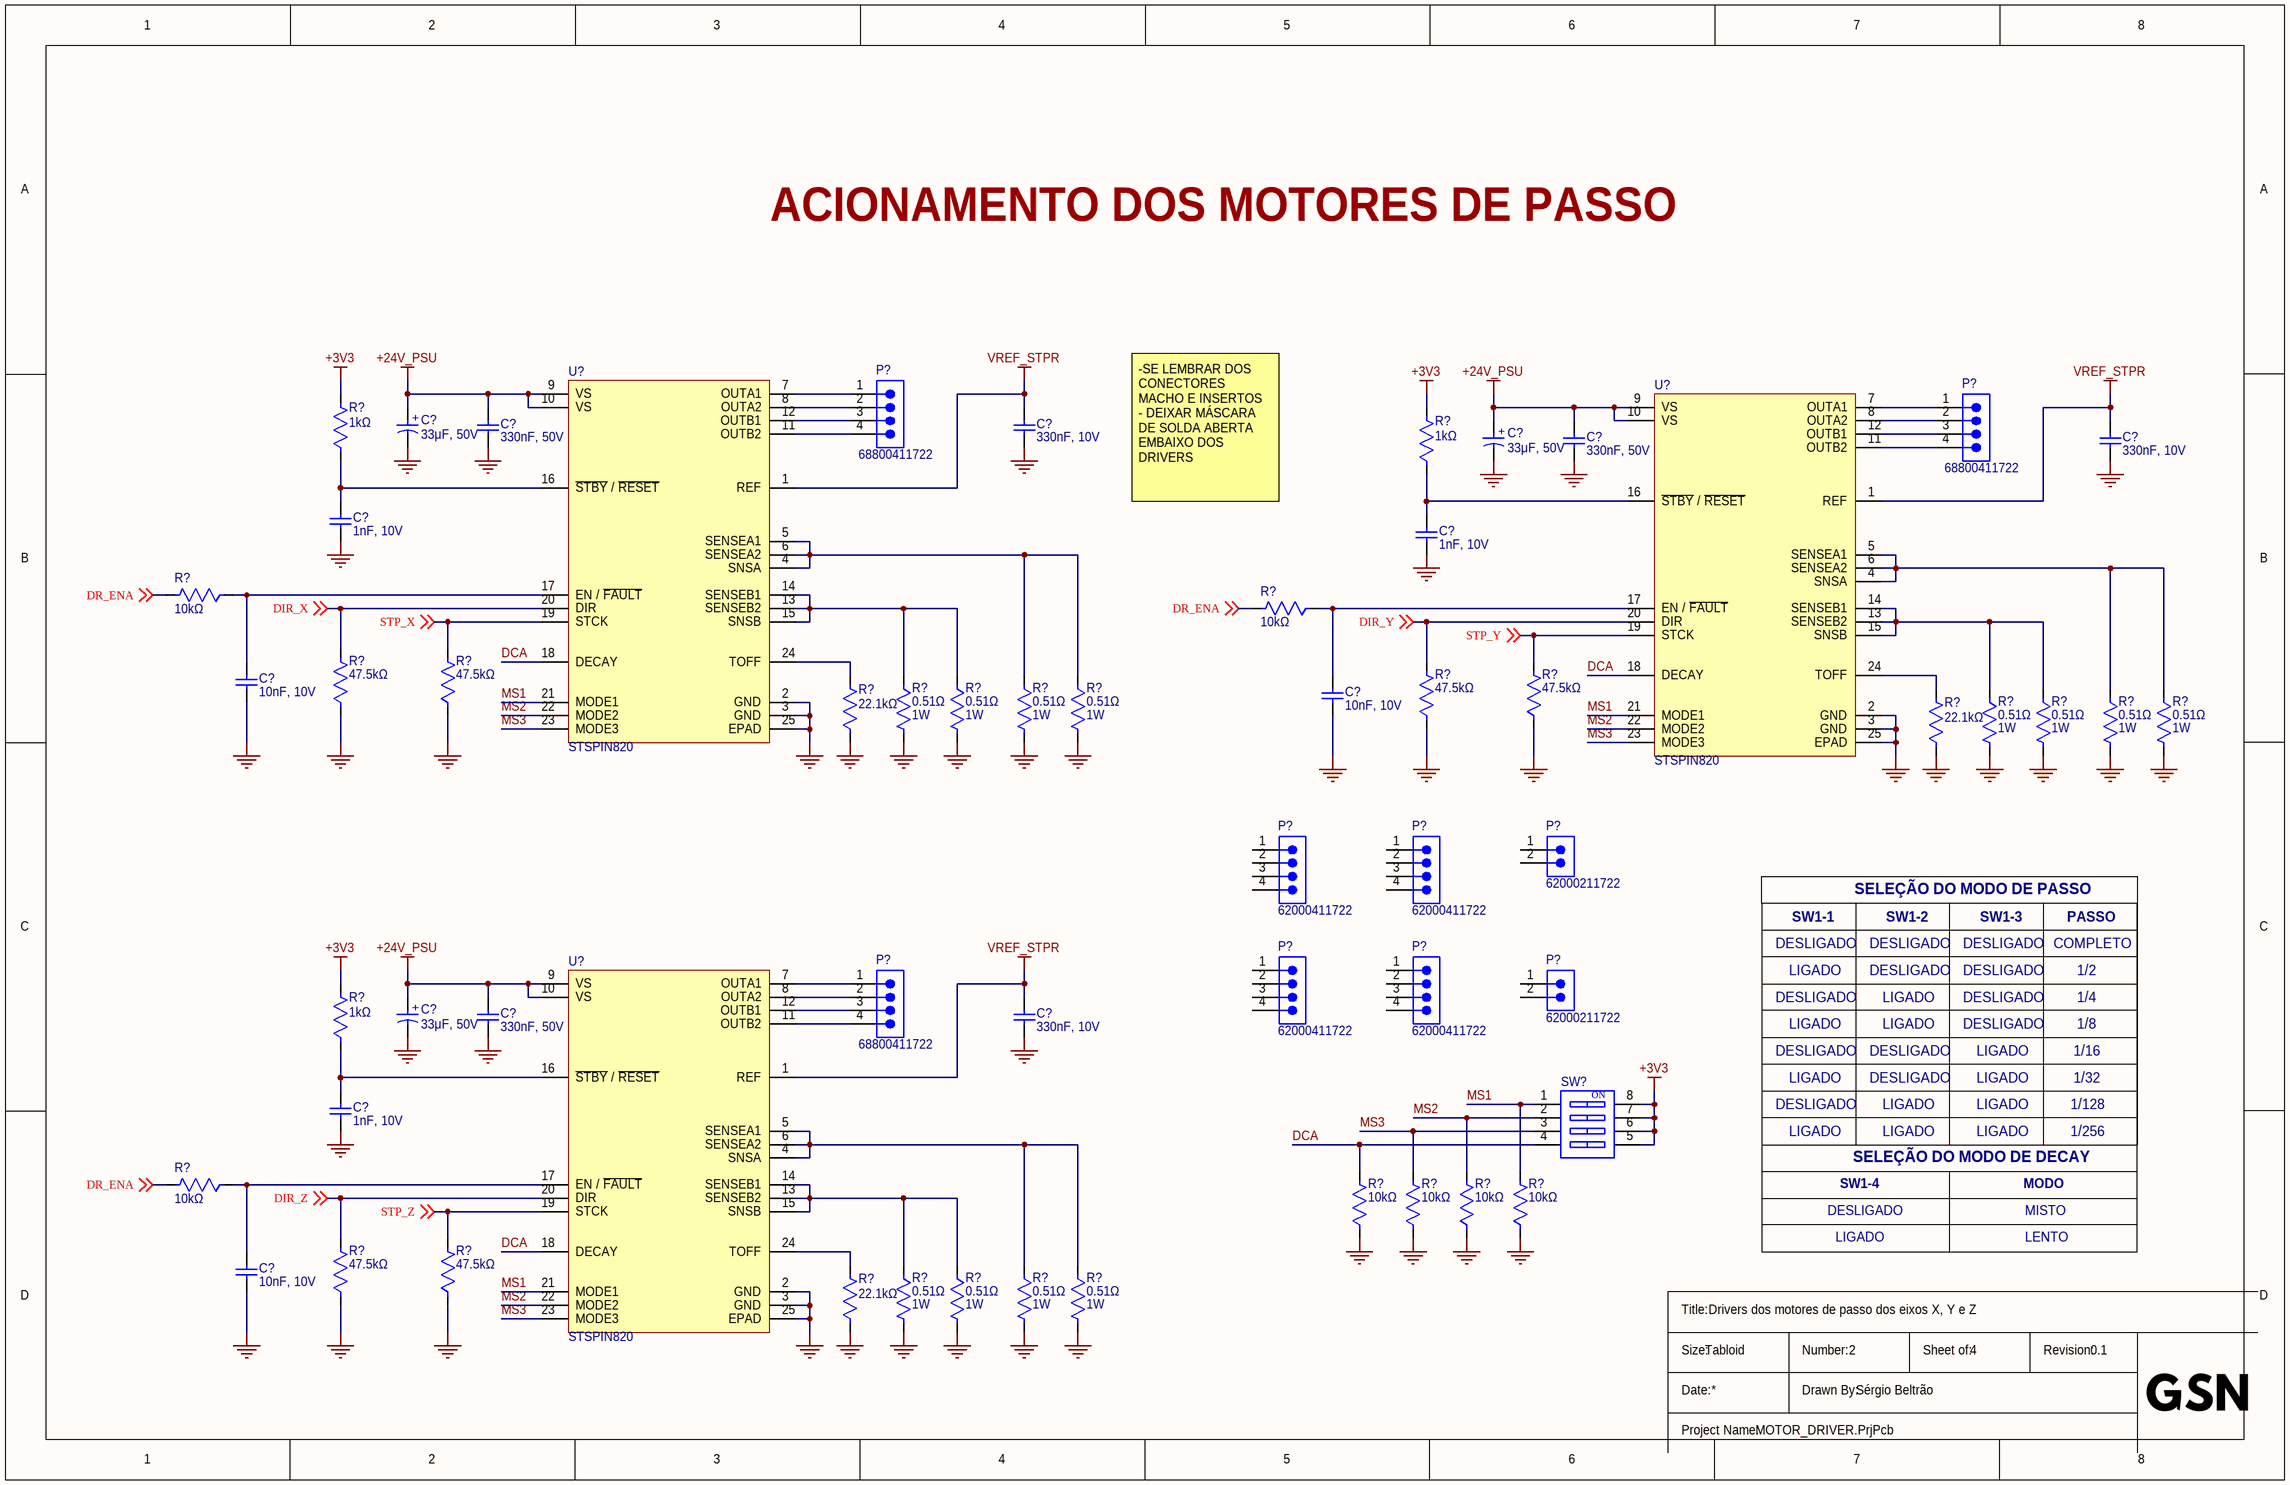
[diagram p1: 2_MOTORES_DE_PASSO.SchDoc]

### Parts
(Parts that share a designator on the sheet are numbered #1, #2 ... from top to bottom, then left to right.)
C?#6  33μF, 50V  [WCAP-ASLI_D8H6.5]
C?#7  33μF, 50V  [WCAP-ASLI_D8H6.5]
C?#8  330nF, 50V  [WCAP-CSGP_0603_L1.6W0.8H0.8_Reflow]
C?#9  330nF, 10V  [WCAP-CSGP_0603_L1.6W0.8H0.8_Reflow]
C?#10  330nF, 50V  [WCAP-CSGP_0603_L1.6W0.8H0.8_Reflow]
C?#11  330nF, 10V  [WCAP-CSGP_0603_L1.6W0.8H0.8_Reflow]
C?#12  1nF, 10V  [WCAP-CSGP_0603_L1.6W0.8H0.8_Reflow]
C?#13  1nF, 10V  [WCAP-CSGP_0603_L1.6W0.8H0.8_Reflow]
C?#14  10nF, 10V  [WCAP-CSGP_0603_L1.6W0.8H0.8_Reflow]
C?#15  10nF, 10V  [WCAP-CSGP_0603_L1.6W0.8H0.8_Reflow]
C?#16  33μF, 50V  [WCAP-ASLI_D8H6.5]
C?#17  330nF, 50V  [WCAP-CSGP_0603_L1.6W0.8H0.8_Reflow]
C?#18  330nF, 10V  [WCAP-CSGP_0603_L1.6W0.8H0.8_Reflow]
C?#19  1nF, 10V  [WCAP-CSGP_0603_L1.6W0.8H0.8_Reflow]
C?#20  10nF, 10V  [WCAP-CSGP_0603_L1.6W0.8H0.8_Reflow]
P?#1  68800411722  [68800411722]
P?#2  68800411722  [68800411722]
P?#3  62000411722  [62000411722]
P?#4  62000411722  [62000411722]
P?#5  62000211722  [62000211722]
P?#6  62000411722  [62000411722]
P?#7  62000411722  [62000411722]
P?#8  68800411722  [68800411722]
P?#9  62000211722  [62000211722]
R?#12  1kΩ  [0603-REFLOW]
R?#13  1kΩ  [0603-REFLOW]
R?#14  10kΩ  [0603-REFLOW]
R?#15  10kΩ  [0603-REFLOW]
R?#16  0.51Ω  Power Rating: 1W  [2010-REFLOW]
R?#17  0.51Ω  Power Rating: 1W  [2010-REFLOW]
R?#18  0.51Ω  Power Rating: 1W  [2010-REFLOW]
R?#19  0.51Ω  Power Rating: 1W  [2010-REFLOW]
R?#20  0.51Ω  Power Rating: 1W  [2010-REFLOW]
R?#21  0.51Ω  Power Rating: 1W  [2010-REFLOW]
R?#22  0.51Ω  Power Rating: 1W  [2010-REFLOW]
R?#23  0.51Ω  Power Rating: 1W  [2010-REFLOW]
R?#24  47.5kΩ  [0603-REFLOW]
R?#25  47.5kΩ  [0603-REFLOW]
R?#26  47.5kΩ  [0603-REFLOW]
R?#27  47.5kΩ  [0603-REFLOW]
R?#28  22.1kΩ  [0603-REFLOW]
R?#29  22.1kΩ  [0603-REFLOW]
R?#30  1kΩ  [0603-REFLOW]
R?#31  10kΩ  [0603-REFLOW]
R?#32  10kΩ  [0603-REFLOW]
R?#33  10kΩ  [0603-REFLOW]
R?#34  10kΩ  [0603-REFLOW]
R?#35  10kΩ  [0603-REFLOW]
R?#36  0.51Ω  Power Rating: 1W  [2010-REFLOW]
R?#37  0.51Ω  Power Rating: 1W  [2010-REFLOW]
R?#38  0.51Ω  Power Rating: 1W  [2010-REFLOW]
R?#39  0.51Ω  Power Rating: 1W  [2010-REFLOW]
R?#40  47.5kΩ  [0603-REFLOW]
R?#41  47.5kΩ  [0603-REFLOW]
R?#42  22.1kΩ  [0603-REFLOW]
SW?  416131160804  [416131160804]  (value not drawn)
U?#4  STSPIN820  [24-TQFPN]
U?#5  STSPIN820  [24-TQFPN]
U?#6  STSPIN820  [24-TQFPN]

### Nets
+3V3: R?#12.2 R?#13.2 R?#30.2 SW?.5 SW?.6 SW?.7 SW?.8
+24V_PSU: C?#6.1(P) C?#7.1(P) C?#8.2 C?#10.2 C?#16.1(P) C?#17.2 U?#4.9(VS) U?#4.10(VS) U?#5.9(VS) U?#5.10(VS) U?#6.9(VS) U?#6.10(VS)
GND: C?#6.2(N) C?#7.2(N) C?#8.1 C?#9.1 C?#10.1 C?#11.1 C?#12.1 C?#13.1 C?#14.1 C?#15.1 C?#16.2(N) C?#17.1 C?#18.1 C?#19.1 C?#20.1 R?#16.2 R?#17.2 R?#18.2 R?#19.2 R?#20.2 R?#21.2 R?#22.2 R?#23.2 R?#24.1 R?#25.1 R?#26.1 R?#27.1 R?#28.1 R?#29.1 R?#32.1 R?#33.1 R?#34.1 R?#35.1 R?#36.2 R?#37.2 R?#38.2 R?#39.2 R?#40.1 R?#41.1 R?#42.1 U?#4.2(GND) U?#4.3(GND) U?#4.25(EPAD) U?#5.2(GND) U?#5.3(GND) U?#5.25(EPAD) U?#6.2(GND) U?#6.3(GND) U?#6.25(EPAD)
VREF_STPR: C?#9.2 C?#11.2 C?#18.2 U?#4.1(REF) U?#5.1(REF) U?#6.1(REF)
DCA: R?#32.2 SW?.4 U?#4.18(DECAY) U?#5.18(DECAY) U?#6.18(DECAY)
DIR_X: R?#24.2 U?#4.20(DIR) ; off-sheet DIR_X
DIR_Y: R?#26.2 U?#5.20(DIR) ; off-sheet DIR_Y
DIR_Z: R?#40.2 U?#6.20(DIR) ; off-sheet DIR_Z
DR_ENA: R?#14.2 R?#15.2 R?#31.2 ; off-sheet DR_ENA
MS1: R?#35.2 SW?.1 U?#4.21(MODE1) U?#5.21(MODE1) U?#6.21(MODE1)
MS2: R?#34.2 SW?.2 U?#4.22(MODE2) U?#5.22(MODE2) U?#6.22(MODE2)
MS3: R?#33.2 SW?.3 U?#4.23(MODE3) U?#5.23(MODE3) U?#6.23(MODE3)
STP_X: R?#25.2 U?#4.19(STCK) ; off-sheet STP_X
STP_Y: R?#27.2 U?#5.19(STCK) ; off-sheet STP_Y
STP_Z: R?#41.2 U?#6.19(STCK) ; off-sheet STP_Z
NetC?#12_2: C?#12.2 R?#12.1 U?#4.16(~{STBY}_/_~{RESET})
NetC?#13_2: C?#13.2 R?#13.1 U?#5.16(~{STBY}_/_~{RESET})
NetC?#14_2: C?#14.2 R?#14.1 U?#4.17(EN_/_~{FAULT})
NetC?#15_2: C?#15.2 R?#15.1 U?#5.17(EN_/_~{FAULT})
NetC?#19_2: C?#19.2 R?#30.1 U?#6.16(~{STBY}_/_~{RESET})
NetC?#20_2: C?#20.2 R?#31.1 U?#6.17(EN_/_~{FAULT})
NetP?#1_1: P?#1.1 U?#4.7(OUTA1)
NetP?#1_2: P?#1.2 U?#4.8(OUTA2)
NetP?#1_3: P?#1.3 U?#4.12(OUTB1)
NetP?#1_4: P?#1.4 U?#4.11(OUTB2)
NetP?#2_1: P?#2.1 U?#5.7(OUTA1)
NetP?#2_2: P?#2.2 U?#5.8(OUTA2)
NetP?#2_3: P?#2.3 U?#5.12(OUTB1)
NetP?#2_4: P?#2.4 U?#5.11(OUTB2)
NetP?#8_1: P?#8.1 U?#6.7(OUTA1)
NetP?#8_2: P?#8.2 U?#6.8(OUTA2)
NetP?#8_3: P?#8.3 U?#6.12(OUTB1)
NetP?#8_4: P?#8.4 U?#6.11(OUTB2)
NetR?#16_1: R?#16.1 R?#17.1 U?#4.13(SENSEB2) U?#4.14(SENSEB1) U?#4.15(SNSB)
NetR?#18_1: R?#18.1 R?#19.1 U?#4.4(SNSA) U?#4.5(SENSEA1) U?#4.6(SENSEA2)
NetR?#20_1: R?#20.1 R?#21.1 U?#5.13(SENSEB2) U?#5.14(SENSEB1) U?#5.15(SNSB)
NetR?#22_1: R?#22.1 R?#23.1 U?#5.4(SNSA) U?#5.5(SENSEA1) U?#5.6(SENSEA2)
NetR?#28_2: R?#28.2 U?#4.24(TOFF)
NetR?#29_2: R?#29.2 U?#5.24(TOFF)
NetR?#36_1: R?#36.1 R?#37.1 U?#6.13(SENSEB2) U?#6.14(SENSEB1) U?#6.15(SNSB)
NetR?#38_1: R?#38.1 R?#39.1 U?#6.4(SNSA) U?#6.5(SENSEA1) U?#6.6(SENSEA2)
NetR?#42_2: R?#42.2 U?#6.24(TOFF)

Not connected (* = marked no-connect by the designer): P?#3 1 2 3 4; P?#4 1 2 3 4; P?#5 1 2; P?#6 1 2 3 4; P?#7 1 2 3 4; P?#9 1 2

### Notes on the sheet
- ACIONAMENTO DOS MOTORES DE PASSO
- -SE LEMBRAR DOS CONECTORES MACHO E INSERTOS
  - DEIXAR MÁSCARA DE SOLDA ABERTA EMBAIXO DOS DRIVERS
- SELEÇÃO DO MODO DE PASSO
- DESLIGADO
- SW1-1
- SW1-2
- SW1-3
- COMPLETO
- PASSO
- LIGADO
- 1/2
- 1/4
- 1/8
- 1/16
- 1/32
- SELEÇÃO DO MODO DE DECAY
- 1/128
- 1/256
- SW1-4
- MODO
- MISTO
- LENTO
- Drivers dos motores de passo dos eixos X, Y e Z
- Title:
- Size:
- Tabloid
- Number:
- Sheet of:
- Revision:
- Date:
- Project Name:
- Drawn By:
- (in symbol 416131160804) ON
- (in symbol 865080649011) +

### Library data of the parts
C?#6 C?#7 C?#16 = 865080649011: WCAP-ASLI Aluminum Electrolytic Capacitor, V-Chip, SMT, 8mm x 6.5mm, 33μF, 50V; Manufacturer: Wurth Elektronik; Capacitance: 33uF; Dissipation Factor: 12%; Endurance: 2000h; Impedance: 700mohm; Leakage Current: 16.5uA; Ripple Current: 200mA; Manufacturer Part Number: 865080649011; Category: Aluminum Electrolytic Capacitors; Match Code: WCAP-ASLI; ComponentLink1Description: Website Link; ComponentLink1URL: https://www.we-online.com/redexpert/article/865080649011?ad; ComponentLink2Description: Datasheet Link; ComponentLink2URL: https://www.we-online.com/redexpert/spec/865080649011?ad; Mount: Surface Mount; Operating Temperature Min: -55degC; Operating Temperature Max: 105degC; Packaging: Tape and Reel; Height: 6.5mm; Diameter: 8mm; Rated Voltage (DC): 50V
C?#8 C?#10 C?#17 = 885012206121: WCAP-CSGP Multilayer Ceramic Chip Capacitor, General Purpose, size 0603, 330nF, 50V; Manufacturer: Wurth Elektronik; Case/Size Code: 0603; Capacitance Tolerance: +/-10%; Ceramic Type: X7R; Dissipation Factor: 10%; Insulation Resistance: 1.5GΩ; Technical Reference: X7R0603334K050DFCT10000; Manufacturer Part Number: 885012206121; Category: Multilayer Ceramic Chip Capacitors; Match Code: WCAP-CSGP; ComponentLink1Description: Website Link; ComponentLink1URL: https://www.we-online.com/redexpert/article/885012206121?ad; ComponentLink2Description: Datasheet Link; ComponentLink2URL: https://www.we-online.com/redexpert/spec/885012206121?ad; Mount: Surface Mount; Min Operating Temperature: -55°C; Max Operating Temperature: 125°C; Packaging: Tape and Reel; Length: 1.6mm; Width: 0.8mm; Height: 0.8mm; Capacitance: 330nF; Rated Voltage (DC): 50V
C?#9 C?#11 C?#18 = 885012206023: WCAP-CSGP Multilayer Ceramic Chip Capacitor, General Purpose, size 0603, 330nF, 10V; Manufacturer: Wurth Elektronik; Case/Size Code: 0603; Capacitance Tolerance: +/-10%; Ceramic Type: X7R; Dissipation Factor: 10%; Insulation Resistance: 1.5GΩ; Technical Reference: X7R0603334K010DFCT10000; Manufacturer Part Number: 885012206023; Category: Multilayer Ceramic Chip Capacitors; Match Code: WCAP-CSGP; ComponentLink1Description: Website Link; ComponentLink1URL: https://www.we-online.com/redexpert/article/885012206023?ad; ComponentLink2Description: Datasheet Link; ComponentLink2URL: https://www.we-online.com/redexpert/spec/885012206023?ad; Mount: Surface Mount; Min Operating Temperature: -55°C; Max Operating Temperature: 125°C; Packaging: Tape and Reel; Length: 1.6mm; Width: 0.8mm; Height: 0.8mm; Capacitance: 330nF; Rated Voltage (DC): 10V
C?#12 C?#13 C?#19 = 885012206008: WCAP-CSGP Multilayer Ceramic Chip Capacitor, General Purpose, size 0603, 1nF, 10V; Manufacturer: Wurth Elektronik; Case/Size Code: 0603; Capacitance Tolerance: +/-10%; Ceramic Type: X7R; Dissipation Factor: 5%; Insulation Resistance: 10GΩ; Technical Reference: X7R0603102K010DFCT10000; Manufacturer Part Number: 885012206008; Category: Multilayer Ceramic Chip Capacitors; Match Code: WCAP-CSGP; ComponentLink1Description: Website Link; ComponentLink1URL: https://www.we-online.com/redexpert/article/885012206008?ad; ComponentLink2Description: Datasheet Link; ComponentLink2URL: https://www.we-online.com/redexpert/spec/885012206008?ad; Mount: Surface Mount; Min Operating Temperature: -55°C; Max Operating Temperature: 125°C; Packaging: Tape and Reel; Length: 1.6mm; Width: 0.8mm; Height: 0.8mm; Capacitance: 1nF; Rated Voltage (DC): 10V
C?#14 C?#15 C?#20 = 885012206014: WCAP-CSGP Multilayer Ceramic Chip Capacitor, General Purpose, size 0603, 10nF, 10V; Manufacturer: Wurth Elektronik; Case/Size Code: 0603; Capacitance Tolerance: +/-10%; Ceramic Type: X7R; Dissipation Factor: 5%; Insulation Resistance: 10GΩ; Technical Reference: X7R0603103K010DFCT10000; Manufacturer Part Number: 885012206014; Category: Multilayer Ceramic Chip Capacitors; Match Code: WCAP-CSGP; ComponentLink1Description: Website Link; ComponentLink1URL: https://www.we-online.com/redexpert/article/885012206014?ad; ComponentLink2Description: Datasheet Link; ComponentLink2URL: https://www.we-online.com/redexpert/spec/885012206014?ad; Mount: Surface Mount; Min Operating Temperature: -55°C; Max Operating Temperature: 125°C; Packaging: Tape and Reel; Length: 1.6mm; Width: 0.8mm; Height: 0.8mm; Capacitance: 10nF; Rated Voltage (DC): 10V
P?#1 P?#2 P?#8 = 68800411722: WR-WTB “J” Type THT Male Horizontal Shrouded Header, pitch 2.5 mm, 4 pins; Manufacturer: Wurth Elektronik; Contact Resistance: 20 mohm; Rated Current: 3 A; Working Voltage: 250 V(AC); Withstanding Voltage: 800 V(AC); Manufacturer Part Number: 68800411722; Category: Wire-to-Board Connector; Match Code: WR-WTB; ComponentLink1Description: Website Link; ComponentLink1URL: https://www.we-online.com/redexpert/article/68800411722?ad; ComponentLink2Description: Datasheet Link; ComponentLink2URL: https://www.we-online.com/redexpert/spec/68800411722?ad; Mount: Through Hole; Operating Temperature Min: -25degC; Operating Temperature Max: 85degC; Packaging: Bag; Length: 12.5 mm; Width: 8.3 mm; Height: 4.2 mm; Gender: Male; Number of Pins: 4; Number of Rows: 1; Orientation: Horizontal; Lead Pitch: 2.5 mm
P?#3 P?#4 P?#6 P?#7 = 62000411722: WR-WTB THT Male Horizontal Shrouded Header, pitch 2 mm, 4 pins; Manufacturer: Wurth Elektronik; Contact Resistance: 20 mohm; Rated Current: 2 A; Working Voltage: 125 V(AC); Withstanding Voltage: 800 V(AC); Manufacturer Part Number: 62000411722; Category: Wire-to-Board Connector; Match Code: WR-WTB; ComponentLink1Description: Website Link; ComponentLink1URL: https://www.we-online.com/redexpert/article/62000411722?ad; ComponentLink2Description: Datasheet Link; ComponentLink2URL: https://www.we-online.com/redexpert/spec/62000411722?ad; Mount: Through Hole; Operating Temperature Min: -25degC; Operating Temperature Max: 85degC; Packaging: Bag; Length: 10 mm; Width: 7.6 mm; Height: 4.5 mm; Gender: Male; Number of Pins: 4; Number of Rows: 1; Orientation: Horizontal; Lead Pitch: 2 mm
P?#5 P?#9 = 62000211722: WR-WTB THT Male Horizontal Shrouded Header, pitch 2 mm, 2 pins; Manufacturer: Wurth Elektronik; Contact Resistance: 20 mohm; Rated Current: 2 A; Working Voltage: 125 V(AC); Withstanding Voltage: 800 V(AC); Manufacturer Part Number: 62000211722; Category: Wire-to-Board Connector; Match Code: WR-WTB; ComponentLink1Description: Website Link; ComponentLink1URL: https://www.we-online.com/redexpert/article/62000211722?ad; ComponentLink2Description: Datasheet Link; ComponentLink2URL: https://www.we-online.com/redexpert/spec/62000211722?ad; Mount: Through Hole; Operating Temperature Min: -25degC; Operating Temperature Max: 85degC; Packaging: Bag; Length: 6 mm; Width: 7.6 mm; Height: 4.5 mm; Gender: Male; Number of Pins: 2; Number of Rows: 1; Orientation: Horizontal; Lead Pitch: 2 mm
R?#12 R?#13 R?#30 = RC0603FR-071KL: RES 1K OHM 1% 1/10W 0603; Manufacturer: Yageo Group; Max Power Dissipation: 100mW; Temperature Coefficient: ±200ppm/°C; Voltage Rating (AC): 50V; Voltage Rating: 75V; Supplier Part Number: 311-1.00KHRCT-ND; Manufacturer Part Number: RC0603FR-071KL; Value: 1kΩ; Case Code (Imperial): 0603; Case Code (Metric): 1608; Case/Package: 0603; Category: Chip SMD Resistors; China RoHS: Non-Compliant; Composition: Thick Film; Contact Plating: Tin; Depth: 800µm; Features: Moisture Resistant; Height: 450µm; Lead Free: Lead Free; Length: 1.6mm; Lifecycle Status: Production; Max Operating Temperature: 155°C; Military Standard: Not; Min Operating Temperature: -55°C; Mounting Technology: Surface Mount; Number of Terminals: 2; Number of Terminations: 2; Packaging: Tape & Reel; Power Dissipation: 100mW; Power Rating: 100mW; Radiation Hardening: No; REACH SVHC: Yes; RoHS: Compliant; Supplier: DigiKey; Termination: SMD/SMT; Tolerance: 1%; Component Link Description: https://www.yageogroup.com/content/datasheet/asset/file/PYU-RC_GROUP_51_ROHS_L; Component Link URL: https://www.yageogroup.com/content/datasheet/asset/file/PYU-RC_GROUP_51_ROHS_L; Datasheet: https://www.yageogroup.com/content/datasheet/asset/file/PYU-RC_GROUP_51_ROHS_L; Voltage Rating (DC): 50V; Weight: 2.012816mg; Width: 800µm; Working Voltage: 75V
R?#14 R?#15 R?#31-R?#35 = RC0603FR-0710KL: RES 10K OHM 1% 1/10W 0603; Manufacturer: Yageo Group; Max Power Dissipation: 100mW; Temperature Coefficient: ±200ppm/°C; Voltage Rating (AC): 50V; Voltage Rating: 75V; Supplier Part Number: 311-10.0KHRCT-ND; Manufacturer Part Number: RC0603FR-0710KL; Value: 10kΩ; Case Code (Imperial): 0603; Case Code (Metric): 1608; Case/Package: 0603; Category: Chip SMD Resistors; China RoHS: Non-Compliant; Composition: Thick Film; Contact Plating: Tin; Depth: 800µm; Features: Moisture Resistant; Height: 450µm; Lead Free: Lead Free; Length: 1.6mm; Lifecycle Status: Production; Max Operating Temperature: 155°C; Military Standard: Not; Min Operating Temperature: -55°C; Mounting Technology: Surface Mount; Number of Terminals: 2; Number of Terminations: 2; Packaging: Tape & Reel; Power Dissipation: 100mW; Power Rating: 100mW; Radiation Hardening: No; REACH SVHC: Yes; RoHS: Compliant; Supplier: DigiKey; Termination: SMD/SMT; Tolerance: 1%; Component Link Description: https://www.yageogroup.com/content/datasheet/asset/file/PYU-RC_GROUP_51_ROHS_L; Component Link URL: https://www.yageogroup.com/content/datasheet/asset/file/PYU-RC_GROUP_51_ROHS_L; Datasheet: https://www.yageogroup.com/content/datasheet/asset/file/PYU-RC_GROUP_51_ROHS_L; Voltage Rating (DC): 50V; Weight: 2.012816mg; Width: 800µm; Working Voltage: 75V
R?#16-R?#23 R?#36-R?#39 = RCWE2010R510FKEA: RES 0.51 OHM 1% 1W 2010; Manufacturer: Vishay; Value: 510mΩ; Temperature Coefficient: 100ppm/°C; Working Voltage: 714.1mV; Supplier: DigiKey; Supplier Part Number: RCWE.51GCT-ND; Manufacturer Part Number: RCWE2010R510FKEA; RoHS: Compliant; Category: Chip SMD Resistors; Stock: 6435; Pricing: 1=0.65, 10=0.417, 25=0.3544, 50=0.3156, 100=0.2824, 250=0.24596, 500=0.22314, 1000=0.20376 (USD); Case/Package: 2010; Case Code (Imperial): 2010; Case Code (Metric): 5025; China RoHS: Non-Compliant; Composition: Thick Film; Contact Plating: Tin; Features: Automotive AEC-Q200, Moisture Resistant; Height: 600µm; Length: 5.0038mm; Lifecycle Status: Production; Max Operating Temperature: 155°C; Max Power Dissipation: 1W; Min Operating Temperature: -55°C; Mounting Technology: Surface Mount; Pins: 2; Number of Terminals: 2; Number of Terminations: 2; Power Dissipation: 1W; Radiation Hardening: No; REACH SVHC: Yes; Schedule B: 8533210045, 8533210045|8533210045|8533210045|8533210045|8533210045; Termination: SMD/SMT; Tolerance: 1%; Width: 2.5mm; ComponentLink1URL: https://datasheet.octopart.com:443/RCWE2010R510FKEA-Vishay-datasheet-170667730.pdf?src-supplier=IHS; ComponentLink1Description: https://datasheet.octopart.com:443/RCWE2010R510FKEA-Vishay-datasheet-170667730.pdf?src-supplier=IHS; ComponentLink2URL: https://datasheet.octopart.com:443/RCWE2010R510FKEA-Vishay-datasheet-78835242.pdf?src-supplier=Newark; ComponentLink2Description: https://datasheet.octopart.com:443/RCWE2010R510FKEA-Vishay-datasheet-78835242.pdf?src-supplier=Newark; ComponentLink3URL: https://datasheet.octopart.com:443/RCWE2010R510FKEA-Vishay-datasheet-10025643.pdf?src-supplier=element14+APAC; ComponentLink3Description: https://datasheet.octopart.com:443/RCWE2010R510FKEA-Vishay-datasheet-10025643.pdf?src-supplier=element14+APAC; ComponentLink4URL: http://sigma.octopart.com:80/rohs_statement/Vishay-company-15.pdf?src-supplier=Compliance+Statements; ComponentLink4Description: http://sigma.octopart.com:80/rohs_statement/Vishay-company-15.pdf?src-supplier=Compliance+Statements
R?#24-R?#27 R?#40 R?#41 = RC0603FR-0747K5L: RES 47.5K OHM 1% 1/10W 0603; Manufacturer: Yageo Group; Max Power Dissipation: 100mW; Temperature Coefficient: ±200ppm/°C; Voltage Rating (AC): 50V; Voltage Rating: 75V; Supplier Part Number: 311-47.5KHRCT-ND; Manufacturer Part Number: RC0603FR-0747K5L; Value: 47.5kΩ; Case Code (Imperial): 0603; Case Code (Metric): 1608; Case/Package: 0603; Category: Chip SMD Resistors; China RoHS: Non-Compliant; Composition: Thick Film; Contact Plating: Tin; Depth: 800µm; Features: Moisture Resistant; Height: 450µm; Lead Free: Lead Free; Length: 1.6mm; Lifecycle Status: Production; Max Operating Temperature: 155°C; Military Standard: Not; Min Operating Temperature: -55°C; Mounting Technology: Surface Mount; Number of Terminals: 2; Number of Terminations: 2; Packaging: Tape & Reel; Power Dissipation: 100mW; Power Rating: 100mW; Radiation Hardening: No; REACH SVHC: Yes; RoHS: Compliant; Supplier: DigiKey; Termination: SMD/SMT; Tolerance: 1%; Component Link Description: https://www.yageogroup.com/content/datasheet/asset/file/PYU-RC_GROUP_51_ROHS_L; Component Link URL: https://www.yageogroup.com/content/datasheet/asset/file/PYU-RC_GROUP_51_ROHS_L; Datasheet: https://www.yageogroup.com/content/datasheet/asset/file/PYU-RC_GROUP_51_ROHS_L; Voltage Rating (DC): 50V; Weight: 2.012816mg; Width: 800µm; Working Voltage: 75V
R?#28 R?#29 R?#42 = RC0603FR-0722K1L: RES 22.1K OHM 1% 1/10W 0603; Manufacturer: Yageo Group; Max Power Dissipation: 100mW; Temperature Coefficient: ±200ppm/°C; Voltage Rating (AC): 50V; Voltage Rating: 75V; Supplier Part Number: 311-22.1KHRCT-ND; Manufacturer Part Number: RC0603FR-0722K1L; Value: 22.1kΩ; Case Code (Imperial): 0603; Case Code (Metric): 1608; Case/Package: 0603; Category: Chip SMD Resistors; China RoHS: Non-Compliant; Composition: Thick Film; Contact Plating: Tin; Depth: 800µm; Features: Moisture Resistant; Height: 450µm; Lead Free: Lead Free; Length: 1.6mm; Lifecycle Status: Production; Max Operating Temperature: 155°C; Military Standard: Not; Min Operating Temperature: -55°C; Mounting Technology: Surface Mount; Number of Terminals: 2; Number of Terminations: 2; Packaging: Tape & Reel; Power Dissipation: 100mW; Power Rating: 100mW; Radiation Hardening: No; REACH SVHC: Yes; RoHS: Compliant; Supplier: DigiKey; Termination: SMD/SMT; Tolerance: 1%; Component Link Description: https://www.yageogroup.com/content/datasheet/asset/file/PYU-RC_GROUP_51_ROHS_L; Component Link URL: https://www.yageogroup.com/content/datasheet/asset/file/PYU-RC_GROUP_51_ROHS_L; Datasheet: https://www.yageogroup.com/content/datasheet/asset/file/PYU-RC_GROUP_51_ROHS_L; Voltage Rating (DC): 50V; Weight: 2.012816mg; Width: 800µm; Working Voltage: 75V
SW? = 416131160804: WS-DISV Small Compact SMD Dip Switch, Flat Actuator with Top Tape, pitch 1.27mm, 4p; Manufacturer: Wurth Elektronik; Actuator Type: Flat Type; Operation Force: 500g; Number of Poles: 4; Rated Current Non-Switching: 100mA; Rated Current Switching: 25mA; Rated Voltage Non-Switching: 50VDC; Rated Voltage Switching: 24VDC; Manufacturer Part Number: 416131160804; Category: Dip Switches; Match Code: WS-DISV; ComponentLink1Description: Website Link; ComponentLink1URL: https://www.we-online.com/redexpert/article/416131160804?ad; ComponentLink2Description: Datasheet Link; ComponentLink2URL: https://www.we-online.com/redexpert/spec/416131160804?ad; Mount: Surface Mount; Min Operating Temperature: -40°C; Max Operating Temperature: 85°C; Packaging: Tape and Reel; Contact Material: Copper Alloy; Contact Plating: Gold; Pitch: 1.27mm
U?#4-U?#6 = STSPIN820: IC MTR DRVR BIPLR 7-45V 24TFQFPN; Manufacturer: STMicroelectronics; Throw Configuration: STEPPER MOTOR CONTROLLER; Supplier: Digikey; Supplier Part Number: 497-17713-1-ND; Manufacturer Part Number: STSPIN820; RoHS: Yes; Category: Motor Drives; Stock: 11767; Pricing: 1=3.03, 10=2.271, 25=2.0804, 100=1.8709, 250=1.77096, 500=1.71068, 1000=1.66108 (USD); Reach SVHC Compliant: Yes; RoHS Compliant: Yes; ComponentLink1URL: https://datasheet.ciiva.com:443/pdfs/VipMasterIC/IC/SGST/SGST-S-A0005002811/SGST-S-A0005002811-1.pdf?src-supplier=IHS+Markit; ComponentLink1Description: https://datasheet.ciiva.com:443/pdfs/VipMasterIC/IC/SGST/SGST-S-A0005002811/SGST-S-A0005002811-1.pdf?src-supplier=IHS+Markit; ComponentLink2URL: http://www.farnell.com/datasheets/2549178.pdf?src-supplier=Farnell; ComponentLink2Description: http://www.farnell.com/datasheets/2549178.pdf?src-supplier=Farnell; ComponentLink3URL: http://www.st.com/content/ccc/resource/technical/document/datasheet/group3/64/0a/8b/fb/e5/29/46/34/DM00436631/files/DM00436631.pdf/jcr:content/translations/en.DM00436631.pdf?src-supplier=Digikey; ComponentLink3Description: http://www.st.com/content/ccc/resource/technical/document/datasheet/group3/64/0a/8b/fb/e5/29/46/34/DM00436631/files/DM00436631.pdf/jcr:content/translations/en.DM00436631.pdf?src-supplier=Digikey; ComponentLink4URL: https://datasheet.octopart.com/STSPIN820-STMicroelectronics-datasheet-99887157.pdf?src-supplier=Newark; ComponentLink4Description: https://datasheet.octopart.com/STSPIN820-STMicroelectronics-datasheet-99887157.pdf?src-supplier=Newark; ComponentLink5URL: http://www.farnell.com/datasheets/2549178.pdf?src-supplier=Newark; ComponentLink5Description: http://www.farnell.com/datasheets/2549178.pdf?src-supplier=Newark; ComponentLink6URL: https://datasheet.octopart.com/STSPIN820-STMicroelectronics-datasheet-163660309.pdf?src-supplier=SHENGYU+ELECTRONICS; ComponentLink6Description: https://datasheet.octopart.com/STSPIN820-STMicroelectronics-datasheet-163660309.pdf?src-supplier=SHENGYU+ELECTRONICS